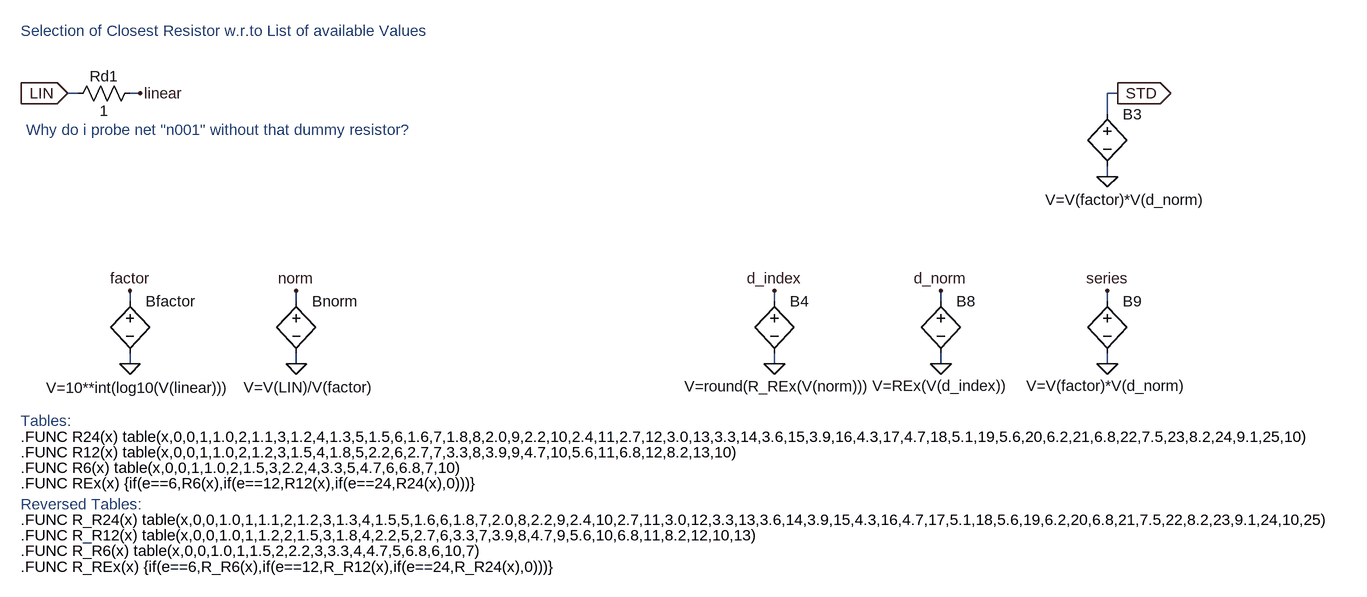
[diagram p0: schematic Eseries.asc]
Eseries.asc, the LTspice schematic file:
Version 4
SHEET 1 2628 980
WIRE 96 -160 80 -160
WIRE 176 160 176 144
WIRE 176 256 176 240
WIRE 192 -160 176 -160
WIRE 432 160 432 144
WIRE 432 256 432 240
WIRE 1168 160 1168 144
WIRE 1168 256 1168 240
WIRE 1424 160 1424 144
WIRE 1424 256 1424 240
WIRE 1680 -128 1680 -160
WIRE 1680 -32 1680 -48
WIRE 1680 160 1680 144
WIRE 1680 256 1680 240
WIRE 1696 -160 1680 -160
FLAG 1680 -32 0
FLAG 1696 -160 STD
IOPIN 1696 -160 Out
FLAG 432 256 0
FLAG 432 144 norm
FLAG 176 256 0
FLAG 176 144 factor
FLAG 80 -160 LIN
IOPIN 80 -160 In
FLAG 1168 256 0
FLAG 1168 144 d_index
FLAG 1424 256 0
FLAG 1424 144 d_norm
FLAG 192 -160 linear
FLAG 1680 256 0
FLAG 1680 144 series
SYMBOL bv 1680 -144 R0
WINDOW 3 28 148 Center 0
SYMATTR Value V=V(factor)*V(d_norm)
SYMATTR InstName B3
SYMBOL bv 432 144 R0
WINDOW 3 19 148 Center 0
SYMATTR Value V=V(LIN)/V(factor)
SYMATTR InstName Bnorm
SYMBOL bv 176 144 R0
WINDOW 3 13 149 Center 0
SYMATTR Value V=10**int(log10(V(linear)))
SYMATTR InstName Bfactor
SYMBOL bv 1168 144 R0
WINDOW 3 6 147 Center 0
SYMATTR Value V=round(R_REx(V(norm)))
SYMATTR InstName B4
SYMBOL bv 1424 144 R0
WINDOW 3 -1 146 Center 0
SYMATTR Value V=REx(V(d_index))
SYMATTR InstName B8
SYMBOL res 192 -176 R90
WINDOW 0 5 56 VBottom 0
WINDOW 3 27 56 VTop 0
SYMATTR InstName Rd1
SYMATTR Value 1
SYMBOL bv 1680 144 R0
WINDOW 3 -1 146 Center 0
SYMATTR Value V=V(factor)*V(d_norm)
SYMATTR InstName B9
TEXT 8 -256 Left 0 ;Selection of Closest Resistor w.r.to List of available Values
TEXT 8 368 Left 0 !.FUNC R24(x) table(x,0,0,1,1.0,2,1.1,3,1.2,4,1.3,5,1.5,6,1.6,7,1.8,8,2.0,9,2.2,10,2.4,11,2.7,12,3.0,13,3.3,14,3.6,15,3.9,16,4.3,17,4.7,18,5.1,19,5.6,20,6.2,21,6.8,22,7.5,23,8.2,24,9.1,25,10)
TEXT 8 392 Left 0 !.FUNC R12(x) table(x,0,0,1,1.0,2,1.2,3,1.5,4,1.8,5,2.2,6,2.7,7,3.3,8,3.9,9,4.7,10,5.6,11,6.8,12,8.2,13,10)
TEXT 8 416 Left 0 !.FUNC R6(x) table(x,0,0,1,1.0,2,1.5,3,2.2,4,3.3,5,4.7,6,6.8,7,10)
TEXT 8 544 Left 0 !.FUNC R_R6(x) table(x,0,0,1.0,1,1.5,2,2.2,3,3.3,4,4.7,5,6.8,6,10,7)
TEXT 8 472 Left 0 ;Reversed Tables:
TEXT 8 520 Left 0 !.FUNC R_R12(x) table(x,0,0,1.0,1,1.2,2,1.5,3,1.8,4,2.2,5,2.7,6,3.3,7,3.9,8,4.7,9,5.6,10,6.8,11,8.2,12,10,13)
TEXT 8 496 Left 0 !.FUNC R_R24(x) table(x,0,0,1.0,1,1.1,2,1.2,3,1.3,4,1.5,5,1.6,6,1.8,7,2.0,8,2.2,9,2.4,10,2.7,11,3.0,12,3.3,13,3.6,14,3.9,15,4.3,16,4.7,17,5.1,18,5.6,19,6.2,20,6.8,21,7.5,22,8.2,23,9.1,24,10,25)
TEXT 8 344 Left 0 ;Tables:
TEXT 16 -104 Left 0 ;Why do i probe net "n001" without that dummy resistor?
TEXT 8 440 Left 0 !.FUNC REx(x) {if(e==6,R6(x),if(e==12,R12(x),if(e==24,R24(x),0)))}
TEXT 8 568 Left 0 !.FUNC R_REx(x) {if(e==6,R_R6(x),if(e==12,R_R12(x),if(e==24,R_R24(x),0)))}

The netlist it stands for:
* Eseries.asc
B3 STD 0 V=V(factor)*V(d_norm)
Bnorm norm 0 V=V(LIN)/V(factor)
Bfactor factor 0 V=10**int(log10(V(linear)))
B4 d_index 0 V=round(R_REx(V(norm)))
B8 d_norm 0 V=REx(V(d_index))
Rd1 linear LIN 1
B9 series 0 V=V(factor)*V(d_norm)
* Selection of Closest Resistor w.r.to List of available Values
.FUNC R24(x) table(x,0,0,1,1.0,2,1.1,3,1.2,4,1.3,5,1.5,6,1.6,7,1.8,8,2.0,9,2.2,10,2.4,11,2.7,12,3.0,13,3.3,14,3.6,15,3.9,16,4.3,17,4.7,18,5.1,19,5.6,20,6.2,21,6.8,22,7.5,23,8.2,24,9.1,25,10)
.FUNC R12(x) table(x,0,0,1,1.0,2,1.2,3,1.5,4,1.8,5,2.2,6,2.7,7,3.3,8,3.9,9,4.7,10,5.6,11,6.8,12,8.2,13,10)
.FUNC R6(x) table(x,0,0,1,1.0,2,1.5,3,2.2,4,3.3,5,4.7,6,6.8,7,10)
.FUNC R_R6(x) table(x,0,0,1.0,1,1.5,2,2.2,3,3.3,4,4.7,5,6.8,6,10,7)
* Reversed Tables:
.FUNC R_R12(x) table(x,0,0,1.0,1,1.2,2,1.5,3,1.8,4,2.2,5,2.7,6,3.3,7,3.9,8,4.7,9,5.6,10,6.8,11,8.2,12,10,13)
.FUNC R_R24(x) table(x,0,0,1.0,1,1.1,2,1.2,3,1.3,4,1.5,5,1.6,6,1.8,7,2.0,8,2.2,9,2.4,10,2.7,11,3.0,12,3.3,13,3.6,14,3.9,15,4.3,16,4.7,17,5.1,18,5.6,19,6.2,20,6.8,21,7.5,22,8.2,23,9.1,24,10,25)
* Tables:
* Why do i probe net "n001" without that dummy resistor?
.FUNC REx(x) {if(e==6,R6(x),if(e==12,R12(x),if(e==24,R24(x),0)))}
.FUNC R_REx(x) {if(e==6,R_R6(x),if(e==12,R_R12(x),if(e==24,R_R24(x),0)))}
.backanno
.end